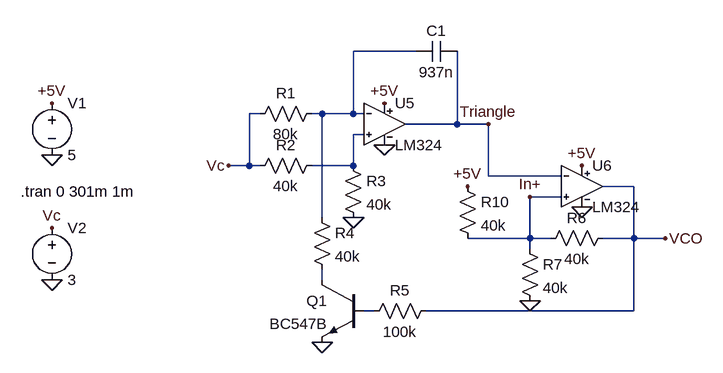
[diagram p0: schematic test.asc]
test.asc, the LTspice schematic file:
Version 4
SHEET 1 1748 680
WIRE 48 32 -48 32
WIRE -192 128 -208 128
WIRE -96 128 -112 128
WIRE -48 128 -48 32
WIRE -48 128 -96 128
WIRE -32 128 -48 128
WIRE 112 144 112 32
WIRE 112 144 32 144
WIRE 160 144 112 144
WIRE -32 160 -48 160
WIRE -208 208 -208 128
WIRE -208 208 -240 208
WIRE -192 208 -208 208
WIRE -48 208 -48 160
WIRE -48 208 -112 208
WIRE 160 224 160 144
WIRE 272 224 160 224
WIRE 384 240 336 240
WIRE 272 256 224 256
WIRE -96 288 -96 128
WIRE 224 320 224 256
WIRE 224 320 128 320
WIRE 256 320 224 320
WIRE 384 320 384 240
WIRE 384 320 336 320
WIRE 432 320 384 320
WIRE 224 336 224 320
WIRE -96 384 -96 368
WIRE -16 432 -32 432
WIRE 384 432 384 320
WIRE 384 432 64 432
FLAG -512 112 +5V
FLAG 0 112 +5V
FLAG 304 208 +5V
FLAG -48 288 0
FLAG -96 480 0
FLAG 224 416 0
FLAG 0 176 0
FLAG 304 272 0
FLAG 128 240 +5V
FLAG 432 320 VCO
FLAG -512 384 0
FLAG -512 304 Vc
FLAG -240 208 Vc
FLAG -512 192 0
FLAG 160 144 Triangle
FLAG 224 256 In+
SYMBOL voltage -512 96 R0
WINDOW 123 0 0 Left 0
WINDOW 39 0 0 Left 0
SYMATTR InstName V1
SYMATTR Value 5
SYMBOL cap 48 48 R270
WINDOW 0 32 32 VTop 0
WINDOW 3 0 32 VBottom 0
SYMATTR InstName C1
SYMATTR Value 937n
SYMBOL res -208 144 R270
WINDOW 0 32 56 VTop 0
WINDOW 3 0 56 VBottom 0
SYMATTR InstName R1
SYMATTR Value 80k
SYMBOL res -208 224 R270
WINDOW 0 32 56 VTop 0
WINDOW 3 0 56 VBottom 0
SYMATTR InstName R2
SYMATTR Value 40k
SYMBOL res -64 192 R0
SYMATTR InstName R3
SYMATTR Value 40k
SYMBOL res -112 272 R0
SYMATTR InstName R4
SYMATTR Value 40k
SYMBOL npn -32 384 M0
SYMATTR InstName Q1
SYMATTR Value BC547B
SYMBOL res 80 416 R90
WINDOW 0 0 56 VBottom 0
WINDOW 3 32 56 VTop 0
SYMATTR InstName R5
SYMATTR Value 100k
SYMBOL res 352 304 R90
WINDOW 0 0 56 VBottom 0
WINDOW 3 32 56 VTop 0
SYMATTR InstName R6
SYMATTR Value 40k
SYMBOL res 208 320 R0
SYMATTR InstName R7
SYMATTR Value 40k
SYMBOL res 112 224 R0
SYMATTR InstName R10
SYMATTR Value 40k
SYMBOL myLib\\LM324 0 80 R0
SYMATTR InstName U5
SYMBOL myLib\\LM324 304 176 R0
SYMATTR InstName U6
SYMBOL voltage -512 288 R0
WINDOW 123 0 0 Left 0
WINDOW 39 0 0 Left 0
SYMATTR InstName V2
SYMATTR Value 3
TEXT -560 248 Left 0 !.tran 0 301m 1m

The netlist it stands for:
* test.asc
V1 +5V 0 5
C1 N001 Triangle 937n
R1 Vc N001 80k
R2 Vc N002 40k
R3 N002 0 40k
R4 N001 N003 40k
Q1 N003 N004 0 0 BC547B
R5 VCO N004 100k
R6 VCO In+ 40k
R7 In+ 0 40k
R10 +5V In+ 40k
XU5 N002 N001 +5V 0 Triangle LM324  ; pins In+ In- V+ V- OUT
XU6 In+ Triangle +5V 0 VCO LM324  ; pins In+ In- V+ V- OUT
V2 Vc 0 3
.model NPN NPN
.model PNP PNP
.lib standard.bjt
.tran 0 301m 1m
.lib myLib\LM324.lib
.backanno
.end